# EAGLE design Interfaz Keyence Diámetro (EAGLE 9.2.2)
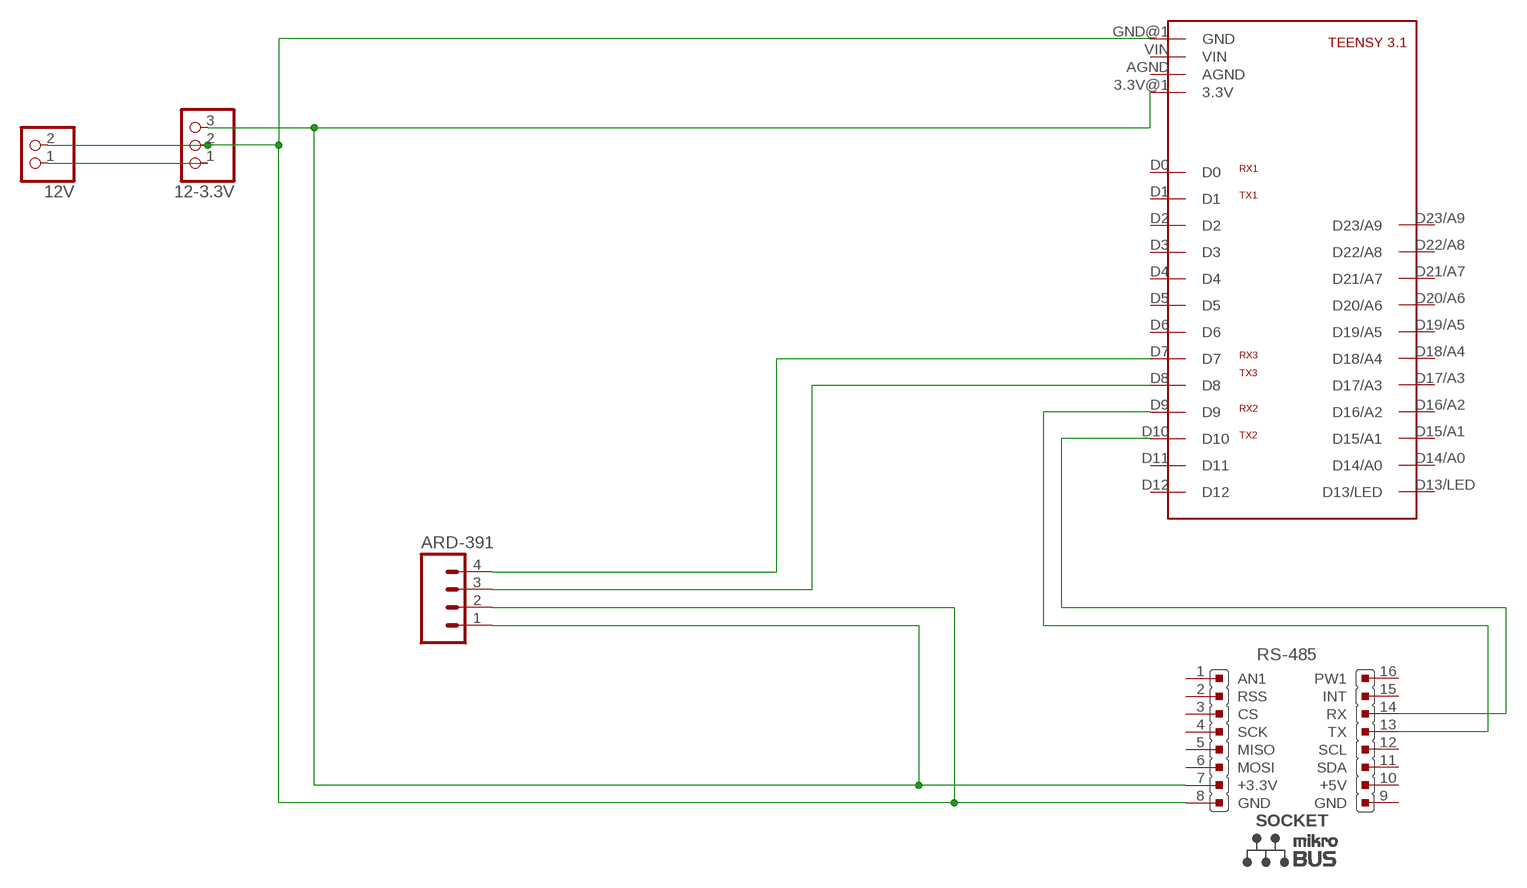
[diagram p0: schematic, sheet 1]

## Parts
12-3.3V  HEADER-1X3ROUND  [1X03_ROUND]
12V  HEADER-1X2ROUND  [1X02_ROUND]
ARD-391  M04NO_SILK_ALL_ROUND  [1X04_NO_SILK_ALL_ROUND]
RS-485  MIKROBUS  [MIKROBUS]
U$1  TEENSY3.1_FRONT  [TEENSY3.1_ALL]

## Nets
N$1: 12-3.3V.1 12V.1
N$2: 12-3.3V.2 12V.2 ARD-391.2 RS-485.8(GND) U$1.GND@1(GND)
N$3: 12-3.3V.3 ARD-391.1 RS-485.7(+3.3V) U$1.3.3V@1(3.3V)
N$4: ARD-391.4 U$1.D7
N$5: ARD-391.3 U$1.D8
N$6: RS-485.13(TX) U$1.D9
N$7: RS-485.14(RX) U$1.D10
Unconnected: RS-485.1(AN1) RS-485.2(RSS) RS-485.3(CS) RS-485.4(SCK) RS-485.5(MISO) RS-485.6(MOSI) RS-485.9(GND) RS-485.10(+5V) RS-485.11(SDA) RS-485.12(SCL) RS-485.15(INT) RS-485.16(PW1) U$1.AGND U$1.D0 U$1.D1 U$1.D2 U$1.D3 U$1.D4 U$1.D5 U$1.D6 U$1.D11 U$1.D12 U$1.D13/LED U$1.D14/A0 U$1.D15/A1 U$1.D16/A2 U$1.D17/A3 U$1.D18/A4 U$1.D19/A5 U$1.D20/A6 U$1.D21/A7 U$1.D22/A8 U$1.D23/A9 U$1.VIN

## Library data of the parts
12-3.3V = microbuilder:HEADER-1X3: PIN HEADER
12V = microbuilder:HEADER-1X2: PIN HEADER
ARD-391 = SparkFun-Connectors:M04: Header 4 Standard 4-pin 0.1" header. Use with straight break away headers (SKU : PRT-00116), right angle break away headers (PRT-00553), swiss pins (PRT-00743), machine pins (PRT-00117), and female headers (PRT-00115). Molex polarized connector foot print use with SKU : PRT-08231 with associated crimp pins and housings. 1MM SMD Version SKU: PRT-10208; PROD_ID: CONN-09696
RS-485 = MikroBUS_baruc:MIKROBUS
U$1 = Frausto:TEENSY3.1_FRONT

## Board
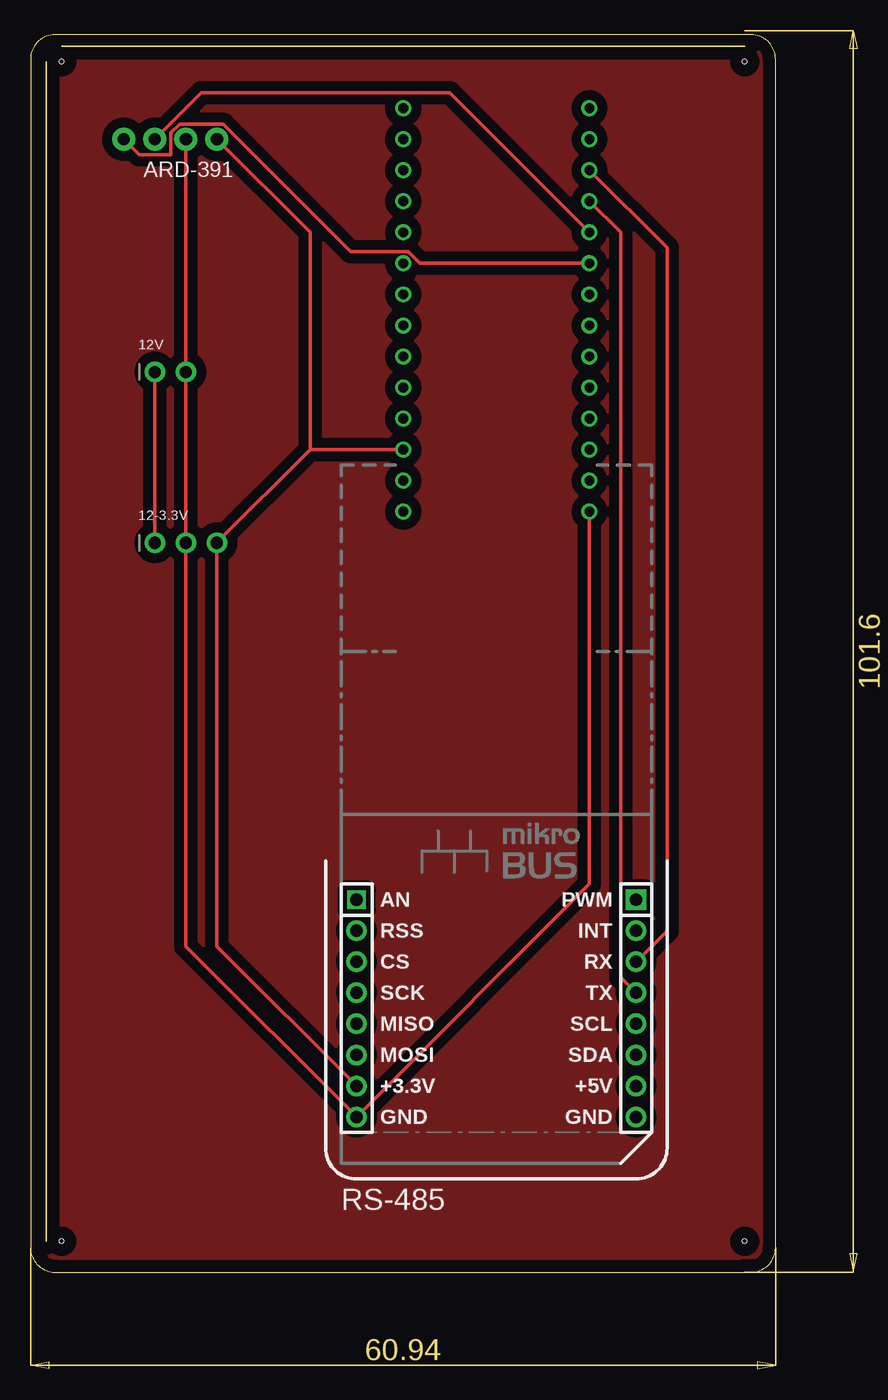
[diagram p1: board, top side]
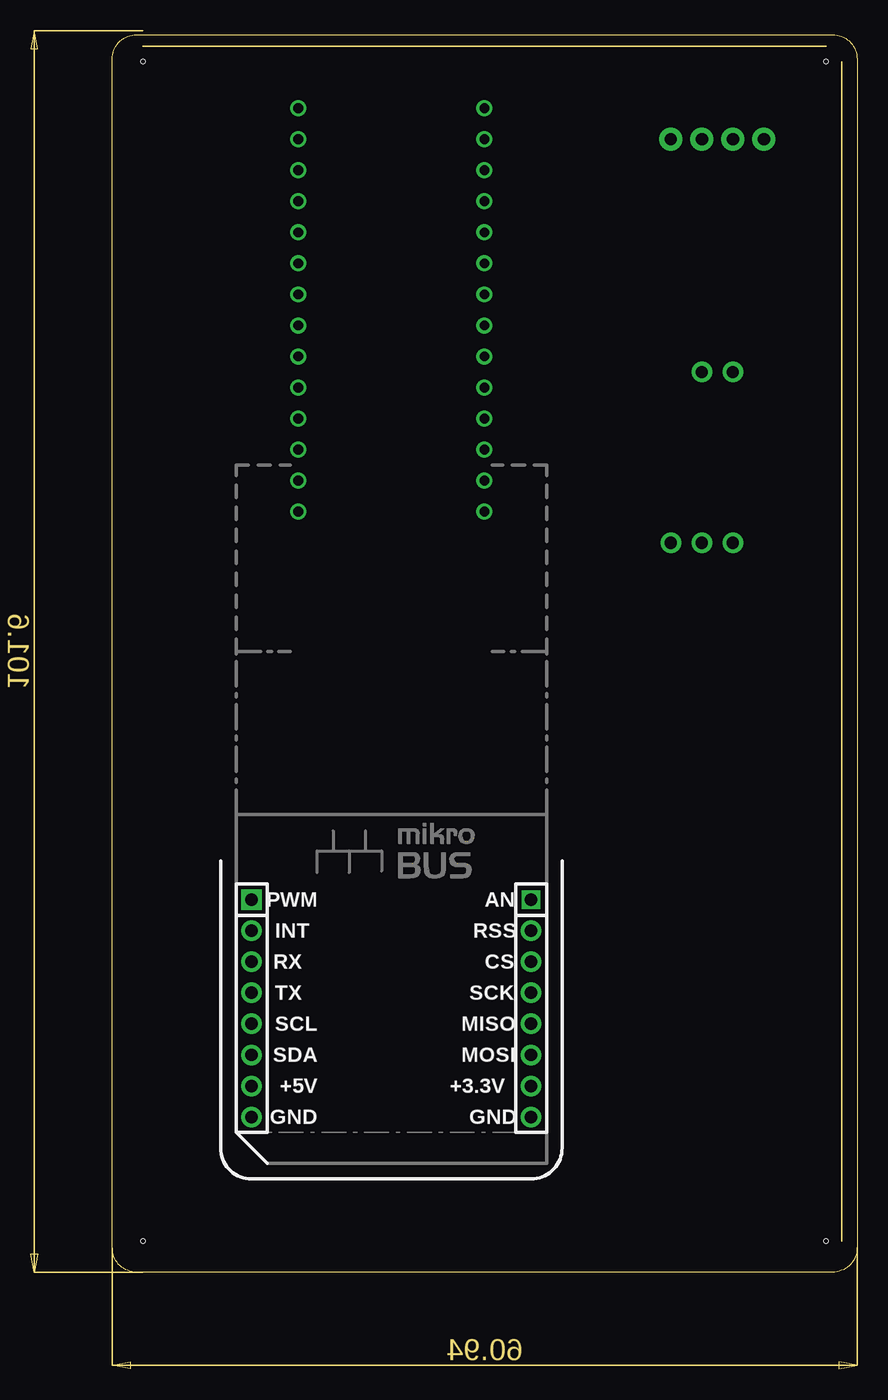
[diagram p2: board, bottom side, seen from below]

Size 60.94 x 101.27 mm. Coordinates in mm from the lower left corner, seen from the top.
Outline: 0,99.27 0,2 arc90 2,0 58.94,0 arc90 60.94,2 60.94,99.27 arc90 58.94,101.27 2,101.27 arc90 0,99.27
Copper layers (1*16): Top 0.035mm / dielectric 1.5mm / Bottom 0.035mm
Design rules "default": minimum track width 6mil, minimum drill 0.35mm, track to track 6mil, track to pad 6mil, pad to pad 6mil, via to via 6mil, smd to smd 6mil, copper to edge 40mil, drill to drill 6mil, minimum pad ring 10mil, minimum via ring 8mil, stop-mask expansion 4mil, vias tented up to drill 0mil, thermal gap 10mil
Holes 0.35 mm at 2.54,99.06 58.42,99.06 2.54,2.54 58.42,2.54

### Footprints (pad centres in the part's own frame; a part is rotated, then mirrored left to right if it is on the bottom)
1X03_ROUND = drill 1 pad 1.676: 1 -2.54,0; 2 0,0; 3 2.54,0
1X02_ROUND = drill 1 pad 1.676: 1 -1.27,0; 2 1.27,0
1X04_NO_SILK_ALL_ROUND = drill 1.016 pad 1.88: 1 0,0; 2 2.54,0; 3 5.08,0; 4 7.62,0
MIKROBUS = drill 1.016 square: 1 1.27,21.59 | drill 1.016 pad 1.676: 2 1.27,19.05; 3 1.27,16.51; 4 1.27,13.97; 5 1.27,11.43; 6 1.27,8.89; 7 1.27,6.35; 8 1.27,3.81; 9 24.13,3.81; 10 24.13,6.35; 11 24.13,8.89; 12 24.13,11.43; 13 24.13,13.97; 14 24.13,16.51; 15 24.13,19.05 | drill 1.016 pad 1.676 square: 16 24.13,21.59
TEENSY3.1_ALL = drill 0.8: 3.3V@1 2.54,5.08; AGND 2.54,7.62; D0 -12.7,7.62; D1 -12.7,5.08; D2 -12.7,2.54; D3 -12.7,0; D4 -12.7,-2.54; D5 -12.7,-5.08; D6 -12.7,-7.62; D7 -12.7,-10.16; D8 -12.7,-12.7; D9 -12.7,-15.24; D10 -12.7,-17.78; D11 -12.7,-20.32; D12 -12.7,-22.86; D13/LED 2.54,-22.86; D14/A0 2.54,-20.32; D15/A1 2.54,-17.78; D16/A2 2.54,-15.24; D17/A3 2.54,-12.7; D18/A4 2.54,-10.16; D19/A5 2.54,-7.62; D20/A6 2.54,-5.08; D21/A7 2.54,-2.54; D22/A8 2.54,0; D23/A9 2.54,2.54; GND@1 -12.7,10.16; VIN 2.54,10.16

### Placement (x,y rotation side)
12-3.3V  12.7,59.69 0 top
12V  11.43,73.66 0 top
ARD-391  15.24,92.71 180 top
RS-485  25.4,8.89 0 top
U$1  33.02,72.39 180 top

### Tracks (layer width: path | path; a pad name or v marks a point on that pad's centre or on a via)
GND
  pour Top (isolate 0.813): 1.27,101.6 58.42,101.6 arc-90 60.96,99.06 60.96,88.9 60.96,2.54 arc-90 58.42,0 54.61,0 2.54,0 arc-90 0,2.54 0,5.08 0,99.06 0,101.6
N$1
  Top 0.305: 12V.1 12-3.3V.1
N$2
  Top 0.305: U$1.GND@1 45.72,31.75 RS-485.8 12.7,26.67 12-3.3V.2 12V.2 ARD-391.2
N$3
  Top 0.305: RS-485.7 15.24,26.67 12-3.3V.3 22.86,67.31 | 22.86,67.31 U$1.3.3V@1 | ARD-391.1 22.86,85.09 22.86,67.31
N$4
  Top 0.305: ARD-391.4 8.89,91.44 11.45,91.44 11.45,93.23 12.18,93.95 15.76,93.95 26.2,83.51 30.88,83.51 31.84,82.55 U$1.D7
N$5
  Top 0.305: ARD-391.3 13.97,96.52 34.29,96.52 U$1.D8
N$6
  Top 0.305: RS-485.13 48.26,24.13 48.26,85.09 U$1.D9
N$7
  Top 0.305: RS-485.14 52.07,27.94 52.07,83.82 U$1.D10